# Altium schematic sheet 3.SchDoc
size 420 x 297 mm
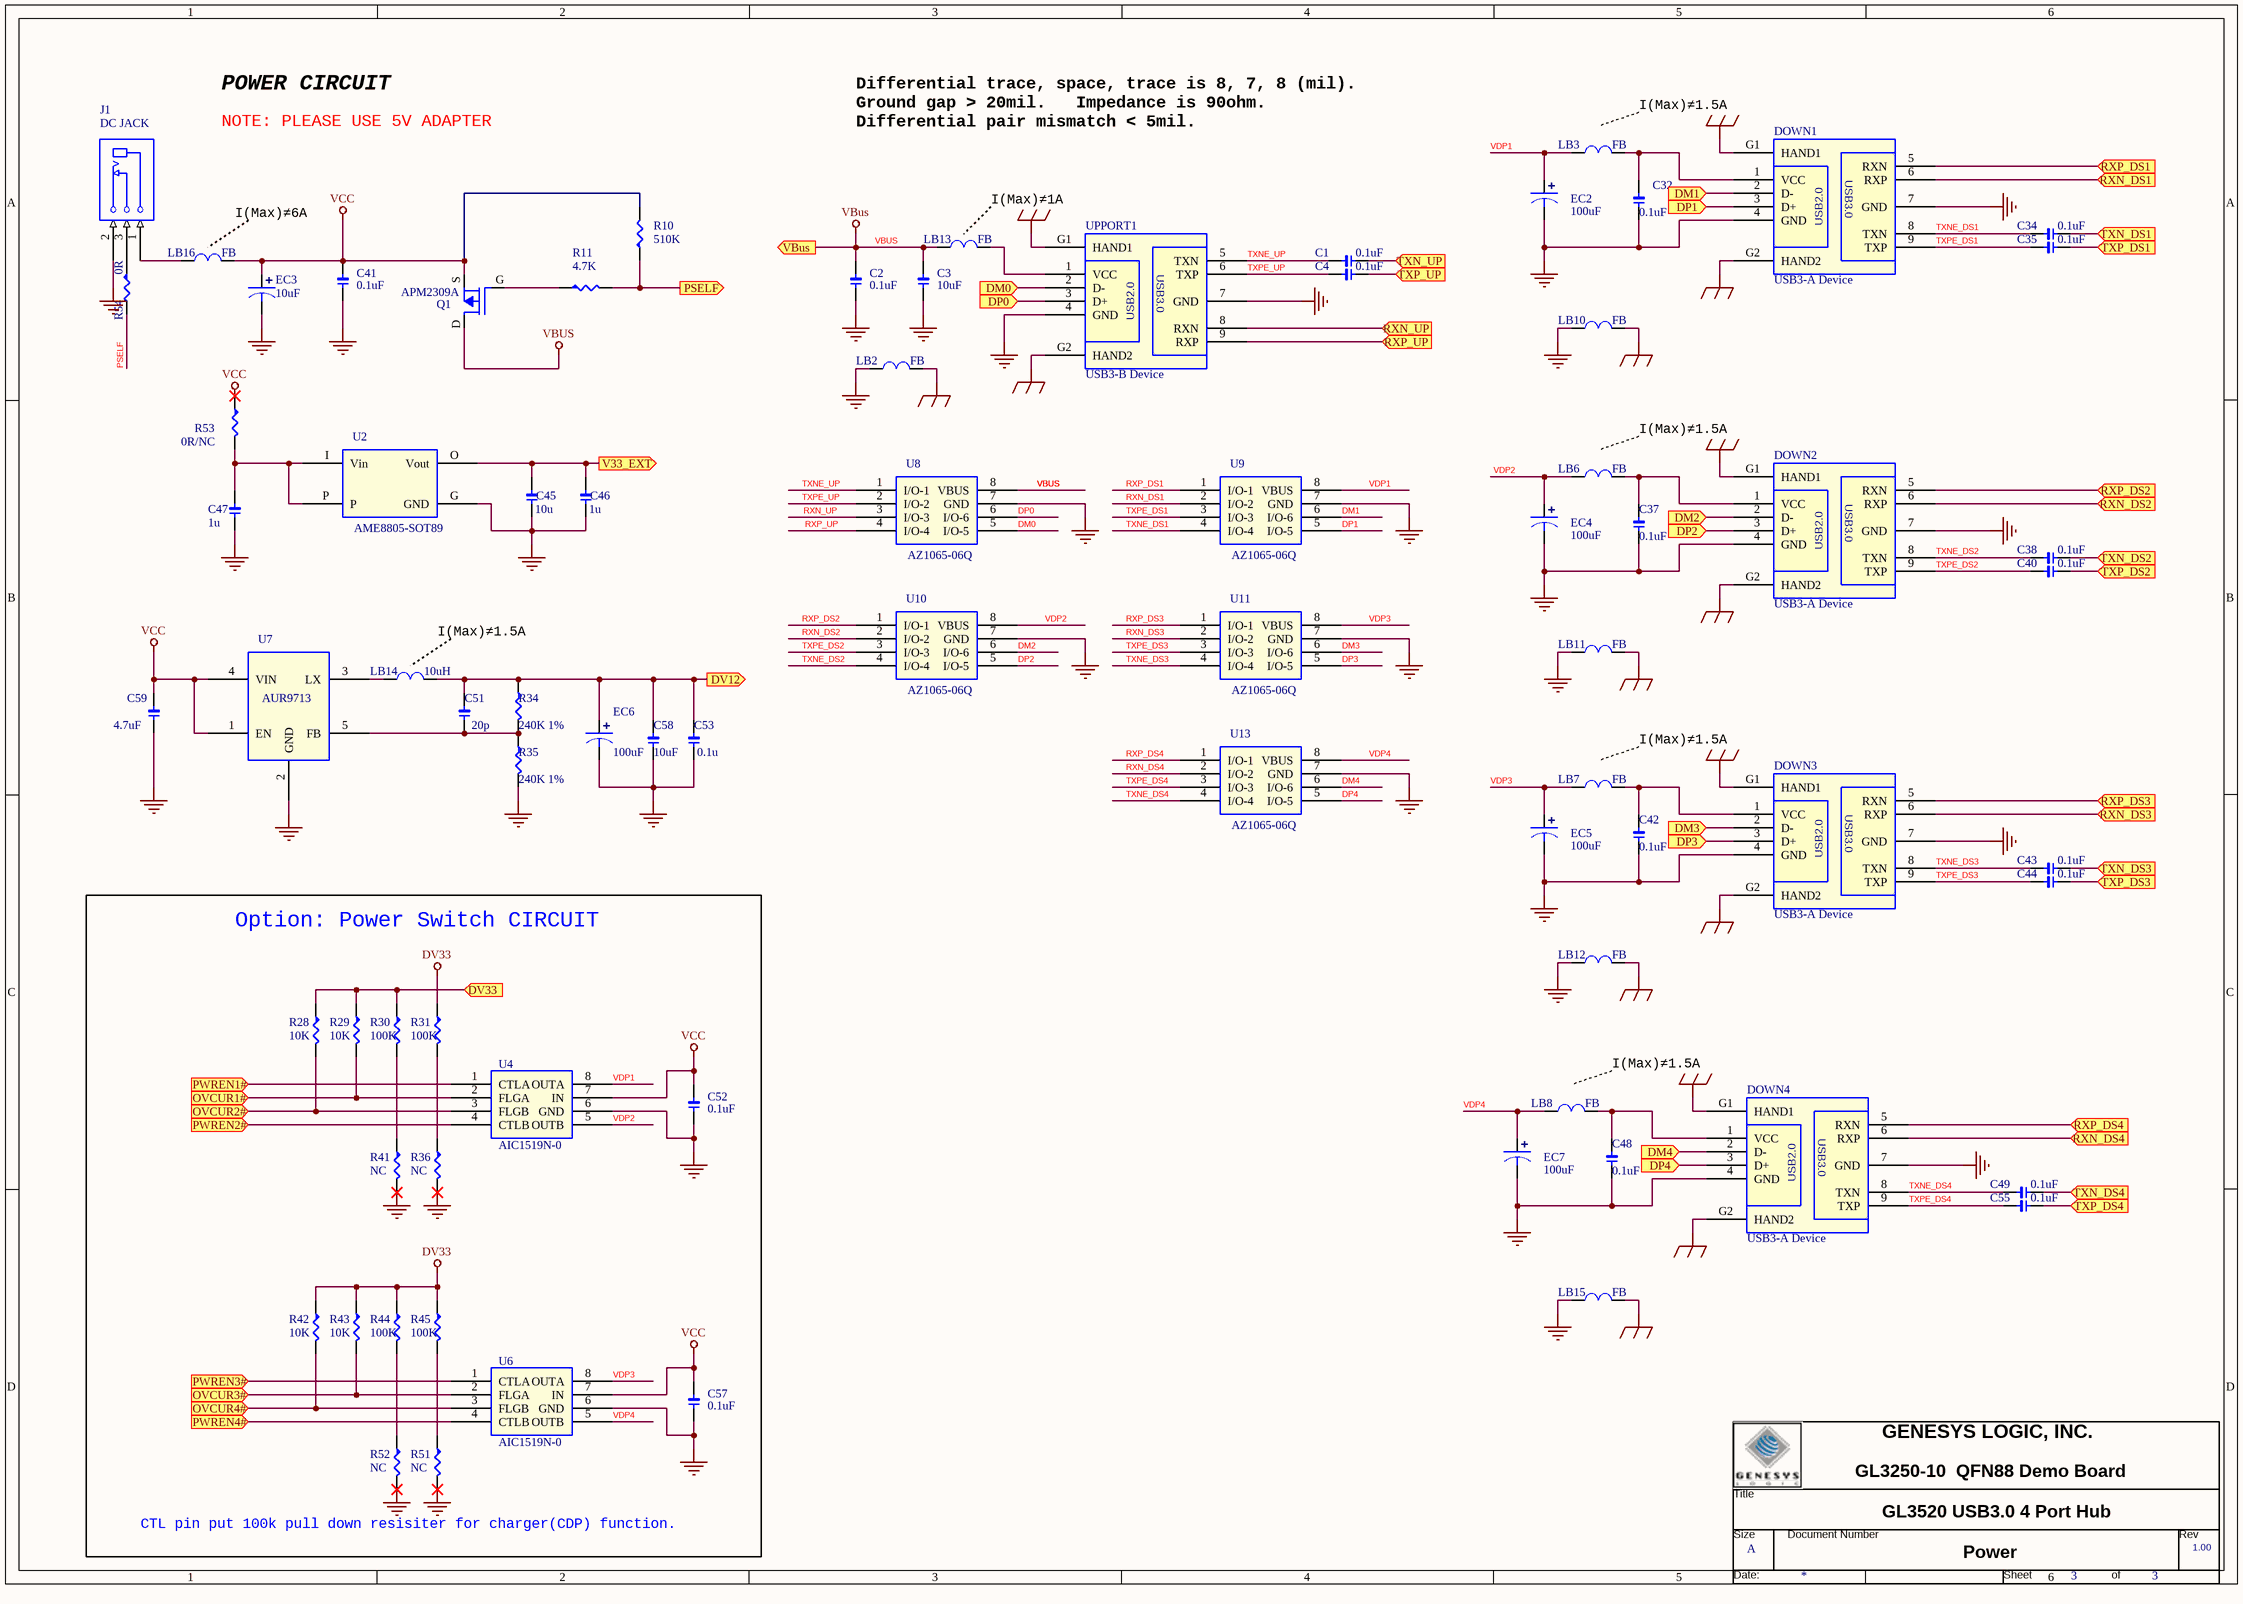
[diagram p0: 3.SchDoc]

## Parts
*  Page Count: 3  Page Size: A  RevCode: 1.00  (hidden comment: Genesys Logic TitleBlock)  (graphical)
C1  0.1uF  [CCS-0402]
C2  0.1uF  [CCS-0402]
C3  10uF  [CCS-0402]
C4  0.1uF  [CCS-0402]
C32  0.1uF  [CCS-0402]
C34  0.1uF  [CCS-0402]
C35  0.1uF  [CCS-0402]
C37  0.1uF  [CCS-0402]
C38  0.1uF  [CCS-0402]
C40  0.1uF  [CCS-0402]
C41  0.1uF  [CCS-0603]
C42  0.1uF  [CCS-0402]
C43  0.1uF  [CCS-0402]
C44  0.1uF  [CCS-0402]
C45  10u  [CCS-0603]
C46  1u  [CCS-0603]
C47  1u  [CCS-0603]
C48  0.1uF  [CCS-0402]
C49  0.1uF  [CCS-0402]
C51  20p  [CCS-0603]
C52  0.1uF  [CCS-0402]
C53  0.1u  [CCS-0603]
C55  0.1uF  [CCS-0402]
C57  0.1uF  [CCS-0402]
C58  10uF  [CCS-0805]
C59  4.7uF  [CCS-0805]
DOWN1  USB3-A Device  [CND-USB3-A]
DOWN2  USB3-A Device  [CND-USB3-A]
DOWN3  USB3-A Device  [CND-USB3-A]
DOWN4  USB3-A Device  [CND-USB3-A]
EC2  100uF  [CED-6_3-2_5]
EC3  10uF  [CED-5-2_5]
EC4  100uF  [CED-6_3-2_5]
EC5  100uF  [CED-6_3-2_5]
EC6  100uF  [CED-5-2_5]
EC7  100uF  [CED-6_3-2_5]
J1  DC JACK  [CND-DCJ-A]
LB2  FB  [LBS-0603]
LB3  FB  [LBS-0603]
LB6  FB  [LBS-0603]
LB7  FB  [LBS-0603]
LB8  FB  [LBS-0603]
LB10  FB  [LBS-0603]
LB11  FB  [LBS-0603]
LB12  FB  [LBS-0603]
LB13  FB  [LBS-0603]
LB14  10uH  [LBS-0805]
LB15  FB  [LBS-0603]
LB16  FB  [LBS-0603]
Q1  APM2309A  [T-SOT23-GSD-A]
R10  510K  [RS-0603]
R11  4.7K  [RS-0603]
R28  10K  [RS-0402]
R29  10K  [RS-0402]
R30  100K  [RS-0402]
R31  100K  [RS-0402]
R34  240K 1%  [R0603]
R35  240K 1%  [R0603]
R36  NC  [RS-0402]
R41  NC  [RS-0402]
R42  10K  [RS-0402]
R43  10K  [RS-0402]
R44  100K  [RS-0402]
R45  100K  [RS-0402]
R51  NC  [RS-0402]
R52  NC  [RS-0402]
R53  0R/NC  [R0603]
R54  0R  [R0603]
U2  AME8805-SOT89  [I-SOT89-GIO-A]
U4  AIC1519N-0  [I-SOP8-1_27A]
U6  AIC1519N-0  [I-SOP8-1_27A]
U7  AUR9713  [I-TSOT23-5P-2_9x1_6x0_95A]
U8  AZ1065-06Q  [i-sop8-0_65a]
U9  AZ1065-06Q  [i-sop8-0_65a]
U10  AZ1065-06Q  [i-sop8-0_65a]
U11  AZ1065-06Q  [i-sop8-0_65a]
U13  AZ1065-06Q  [i-sop8-0_65a]
UPPORT1  USB3-B Device  [CND-USB3-A]

## Blocks framed on the sheet
Option: Power Switch CIRCUIT: C52 C57 R28-R31 R36 R41-R45 R51 R52 U4 U6

## Ports
DM0 (in), DM1 (in), DM2 (in), DM3 (in), DM4 (in), DP0 (in), DP1 (in), DP2 (in), DP3 (in), DP4 (in), DV12 (out), DV33 (in), OVCUR1# (in), OVCUR2# (in), OVCUR3# (in), OVCUR4# (in), PSELF (out), PWREN1# (in), PWREN2# (in), PWREN3# (in), PWREN4# (in), RXN_DS1 (in), RXN_DS2 (in), RXN_DS3 (in), RXN_DS4 (in), RXN_UP (in), RXP_DS1 (in), RXP_DS2 (in), RXP_DS3 (in), RXP_DS4 (in), RXP_UP (in), TXN_DS1 (in), TXN_DS2 (in), TXN_DS3 (in), TXN_DS4 (in), TXN_UP (in), TXP_DS1 (in), TXP_DS2 (in), TXP_DS3 (in), TXP_DS4 (in), TXP_UP (in), V33_EXT (out), VBus (out)

## Nets
DV33: R31.1 R42.1 R43.1 R44.1 R45.1
EGND: DOWN1.G1(HAND1) DOWN1.G2(HAND2) DOWN2.G1(HAND1) DOWN2.G2(HAND2) DOWN3.G1(HAND1) DOWN3.G2(HAND2) DOWN4.G1(HAND1) DOWN4.G2(HAND2) LB2.2 LB10.2 LB11.2 LB12.2 LB15.2 UPPORT1.G1(HAND1) UPPORT1.G2(HAND2)
GND: C2.1 C3.1 C32.1 C37.1 C41.1 C42.1 C45.1 C46.1 C47.1 C48.1 C52.1 C53.1 C57.1 C58.1 C59.1 DOWN1.4(GND) DOWN1.7(GND) DOWN2.4(GND) DOWN2.7(GND) DOWN3.4(GND) DOWN3.7(GND) DOWN4.4(GND) DOWN4.7(GND) EC2.2 EC3.2 EC4.2 EC5.2 EC6.2 EC7.2 J1.2(3T) LB2.1 LB10.1 LB11.1 LB12.1 LB15.1 R35.2 R36.2 R41.2 R51.2 R52.2 U2.G(GND) U4.6(GND) U6.6(GND) U7.2(GND) U8.7(GND) U9.7(GND) U10.7(GND) U11.7(GND) U13.7(GND) UPPORT1.4(GND) UPPORT1.7(GND)
VBUS: C2.2 C3.2 LB13.1 Q1.D U8.8(VBUS) ; port VBus
VCC: C41.2 C52.2 C57.2 C59.2 EC3.1 LB16.2 Q1.S R10.2 R53.1 U4.7(IN) U6.7(IN) U7.1(EN) U7.4(VIN)
DM0: U8.5(I/O-5)
DM0: UPPORT1.2(D-) ; port DM0  [a separate net that carries the same name]
DM1: U9.6(I/O-6)
DM1: DOWN1.2(D-) ; port DM1  [a separate net that carries the same name]
DM2: DOWN2.2(D-) ; port DM2
DM2: U10.6(I/O-6)  [a separate net that carries the same name]
DM3: U11.6(I/O-6)
DM3: DOWN3.2(D-) ; port DM3  [a separate net that carries the same name]
DM4: DOWN4.2(D-) ; port DM4
DM4: U13.6(I/O-6)  [a separate net that carries the same name]
DP0: U8.6(I/O-6)
DP0: UPPORT1.3(D+) ; port DP0  [a separate net that carries the same name]
DP1: U9.5(I/O-5)
DP1: DOWN1.3(D+) ; port DP1  [a separate net that carries the same name]
DP2: DOWN2.3(D+) ; port DP2
DP2: U10.5(I/O-5)  [a separate net that carries the same name]
DP3: U11.5(I/O-5)
DP3: DOWN3.3(D+) ; port DP3  [a separate net that carries the same name]
DP4: DOWN4.3(D+) ; port DP4
DP4: U13.5(I/O-5)  [a separate net that carries the same name]
DV12: C51.2 C53.2 C58.2 EC6.1 LB14.2 R34.1 ; port DV12
DV33: R28.1 R29.1 R30.1 ; port DV33  [a separate net that carries the same name]
OVCUR1#: R29.2 U4.2(FLGA) ; port OVCUR1#
OVCUR2#: R28.2 U4.3(FLGB) ; port OVCUR2#
OVCUR3#: R43.2 U6.2(FLGA) ; port OVCUR3#
OVCUR4#: R42.2 U6.3(FLGB) ; port OVCUR4#
PSELF: R54.2
PSELF: R10.1 R11.2 ; port PSELF  [a separate net that carries the same name]
PWREN1#: U4.1(CTLA) ; port PWREN1#
PWREN2#: U4.4(CTLB) ; port PWREN2#
PWREN3#: U6.1(CTLA) ; port PWREN3#
PWREN4#: U6.4(CTLB) ; port PWREN4#
RXN_DS1: U9.2(I/O-2)
RXN_DS1: DOWN1.6(RXP) ; port RXN_DS1  [a separate net that carries the same name]
RXN_DS2: DOWN2.6(RXP) ; port RXN_DS2
RXN_DS2: U10.2(I/O-2)  [a separate net that carries the same name]
RXN_DS3: U11.2(I/O-2)
RXN_DS3: DOWN3.6(RXP) ; port RXN_DS3  [a separate net that carries the same name]
RXN_DS4: DOWN4.6(RXP) ; port RXN_DS4
RXN_DS4: U13.2(I/O-2)  [a separate net that carries the same name]
RXN_UP: U8.3(I/O-3)
RXN_UP: UPPORT1.8(RXN) ; port RXN_UP  [a separate net that carries the same name]
RXP_DS1: U9.1(I/O-1)
RXP_DS1: DOWN1.5(RXN) ; port RXP_DS1  [a separate net that carries the same name]
RXP_DS2: DOWN2.5(RXN) ; port RXP_DS2
RXP_DS2: U10.1(I/O-1)  [a separate net that carries the same name]
RXP_DS3: U11.1(I/O-1)
RXP_DS3: DOWN3.5(RXN) ; port RXP_DS3  [a separate net that carries the same name]
RXP_DS4: DOWN4.5(RXN) ; port RXP_DS4
RXP_DS4: U13.1(I/O-1)  [a separate net that carries the same name]
RXP_UP: U8.4(I/O-4)
RXP_UP: UPPORT1.9(RXP) ; port RXP_UP  [a separate net that carries the same name]
TXN_DS1: C34.1 ; port TXN_DS1
TXN_DS2: C38.1 ; port TXN_DS2
TXN_DS3: C43.1 ; port TXN_DS3
TXN_DS4: C49.1 ; port TXN_DS4
TXN_UP: C1.1 ; port TXN_UP
TXNE_DS1: C34.2 DOWN1.8(TXN) U9.4(I/O-4)
TXNE_DS2: C38.2 DOWN2.8(TXN) U10.4(I/O-4)
TXNE_DS3: C43.2 DOWN3.8(TXN) U11.4(I/O-4)
TXNE_DS4: C49.2 DOWN4.8(TXN) U13.4(I/O-4)
TXNE_UP: C1.2 U8.1(I/O-1) UPPORT1.5(TXN)
TXP_DS1: C35.1 ; port TXP_DS1
TXP_DS2: C40.1 ; port TXP_DS2
TXP_DS3: C44.1 ; port TXP_DS3
TXP_DS4: C55.1 ; port TXP_DS4
TXP_UP: C4.1 ; port TXP_UP
TXPE_DS1: C35.2 DOWN1.9(TXP) U9.3(I/O-3)
TXPE_DS2: C40.2 DOWN2.9(TXP) U10.3(I/O-3)
TXPE_DS3: C44.2 DOWN3.9(TXP) U11.3(I/O-3)
TXPE_DS4: C55.2 DOWN4.9(TXP) U13.3(I/O-3)
TXPE_UP: C4.2 U8.2(I/O-2) UPPORT1.6(TXP)
V33_EXT: C45.2 C46.2 U2.O(Vout) ; port V33_EXT
VDP1: EC2.1 LB3.1 U4.8(OUTA) U9.8(VBUS)
VDP2: EC4.1 LB6.1 U4.5(OUTB) U10.8(VBUS)
VDP3: EC5.1 LB7.1 U6.8(OUTA) U11.8(VBUS)
VDP4: EC7.1 LB8.1 U6.5(OUTB) U13.8(VBUS)
NetC32_2: C32.2 DOWN1.1(VCC) LB3.2
NetC37_2: C37.2 DOWN2.1(VCC) LB6.2
NetC42_2: C42.2 DOWN3.1(VCC) LB7.2
NetC47_2: C47.2 R53.2 U2.I(Vin) U2.P
NetC48_2: C48.2 DOWN4.1(VCC) LB8.2
NetC51_1: C51.1 R34.2 R35.1 U7.5(FB)
NetJ1_1: J1.1(1S) LB16.1
NetJ1_3: J1.3(2TS) R54.1
NetLB13_2: LB13.2 UPPORT1.1(VCC)
NetLB14_1: LB14.1 U7.3(LX)
NetQ1_G: Q1.G R11.1
NetR30_2: R30.2 R41.1
NetR31_2: R31.2 R36.1
NetR44_2: R44.2 R52.1
NetR45_2: R45.2 R51.1

## Notes on the sheet
- NOTE: PLEASE USE 5V ADAPTER
- POWER CIRCUIT
- I(Max)≠1.5A
- Differential trace, space, trace is 8, 7, 8 (mil).
  Ground gap > 20mil.   Impedance is 90ohm.
  Differential pair mismatch < 5mil.
- I(Max)≠6A
- I(Max)≠1A
- GL3250-10  QFN88 Demo Board
- CTL pin put 100k pull down resisiter for charger(CDP) function.
- GL3520 USB3.0 4 Port Hub
- Power
- (in symbol CED-5-2_5) +
- (in symbol CED-6_3-2_5) +
- (in symbol Genesys Logic TitleBlock) GENESYS LOGIC, INC.; Title; Size; Document Number; Rev; Date:; Sheet; of
- (in symbol USB3-A_4) USB3.0; USB2.0
- (in symbol USB3-A_5) USB3.0; USB2.0
- (in symbol USB3-A_6) USB3.0; USB2.0
- (in symbol USB3-A_7) USB3.0; USB2.0

## Library data of the parts
C1 C4 C34 C35 C38 C40 C43 C44 C49 C55 = C-0402: PCB Footprint: CCS-0402O
C2 C3 C32 C37 C42 C48 C52 C57 = C-0402: PCB Footprint: CCS-0603
C41 = C-0603: PCB Footprint: CCS-0603
C45-C47 C51 C53 = C-0603 5%: BOM: SMD-CAP 10pF (0603) 5%; PCB Footprint: CCS-0603
C58 C59 = C-0805: PCB Footprint: CCS-0805
DOWN1 = USB3-A_5: PCB Footprint: CND-USB3A-A
DOWN2 = USB3-A_6: PCB Footprint: CND-USB3A-A
DOWN3 DOWN4 = USB3-A_7: PCB Footprint: CND-USB3A-A
EC2 EC4 EC5 EC7 = CED-6_3-2_5: PCB Footprint: CED-6_3-2_5
EC3 EC6 = CED-5-2_5: PCB Footprint: CED-5-2_5
LB2 LB3 LB6-LB8 LB10-LB13 LB15 LB16 = L-0603
  LB2 LB3 LB6-LB8 LB10-LB13 LB15: PCB Footprint: LBS-0603
  LB16: PCB Footprint: LBS-0805
LB14 = FB-0805: PCB Footprint: LCS-ETP0502-5x6x4_0A
Q1 = FDN360-GSD: PCB Footprint: T-SOT23-GSD-A
R10 R11 = R-0603: PCB Footprint: RS-0603
R28-R31 R36 R41-R45 R51 R52 = R-0402: PCB Footprint: RS-0603
R34 R35 R53 R54 = R-0603 5%: CLASS: DISCRETE; BOM: SMD-R ?K (0603) 5%; PCB Footprint: RS-0603
U4 U6 = AIC1526-SOP: PCB Footprint: I-SOP8-1_27A
U7 = AUR9705_3: PCB Footprint: I-TSOT23-5P-2_9x1_6x0_95A
U8-U11 U13 = CAT25C128/256_0: PCB Footprint: i-sop8-0_65a
UPPORT1 = USB3-A_4: PCB Footprint: CND-USB3B-B
* = Genesys Logic TitleBlock: Page Number: 3; Page Create Date: March  8, 1995; Page Modify Date: *
J1 = DC JACK: PCB Footprint: CND-DCJ-A
U2 = AME8805-SOT89: PCB Footprint: I-SOT89-GIO-A